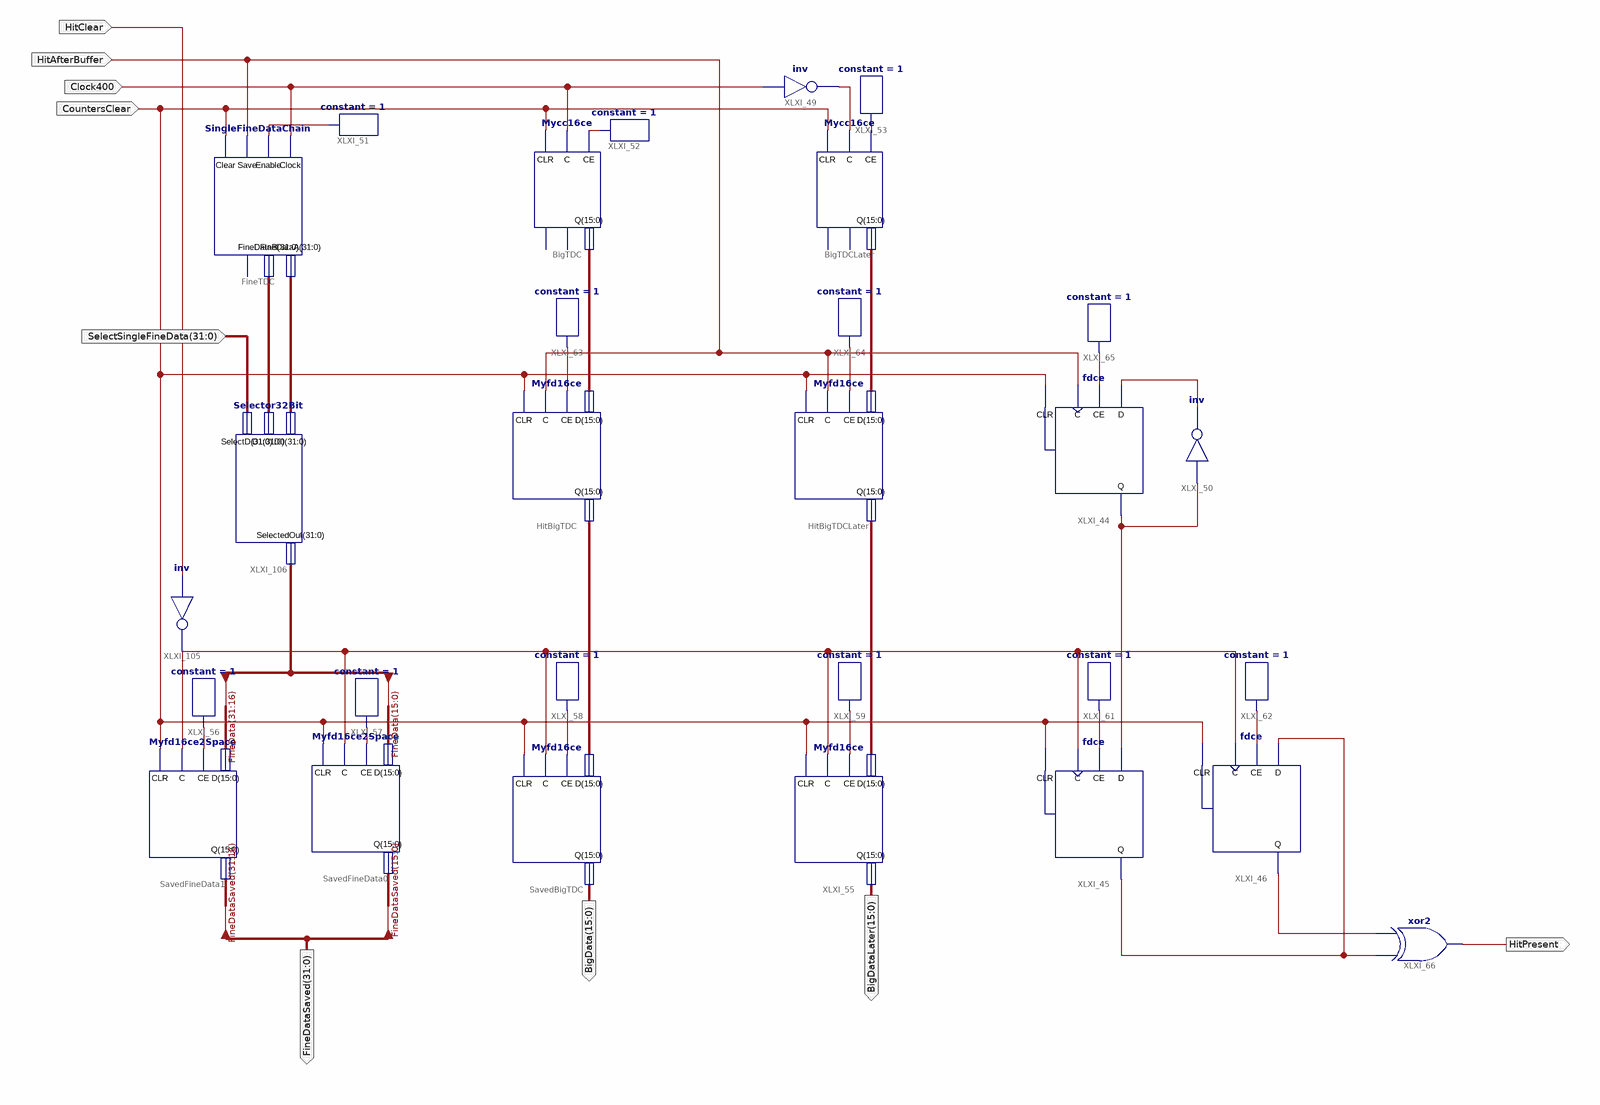
[diagram p0: schematic sheet 1]
// Xilinx ISE schematic SingleTDC.sch (virtex4) as structural Verilog: 29 symbols, 9 ports
module SingleTDC (
  input  Clock400,
  input  HitClear,
  input  HitAfterBuffer,
  input  CountersClear,
  input  [31:0] SelectSingleFineData,
  output [15:0] BigDataLater,
  output [15:0] BigData,
  output [31:0] FineDataSaved,
  output HitPresent
);

  wire InvHitClear, XLXN_193, XLXN_194, XLXN_195, XLXN_220, XLXN_223, XLXN_224, XLXN_234, XLXN_235, XLXN_236,
       XLXN_238, XLXN_239, XLXN_240, XLXN_241, XLXN_242, XLXN_243, XLXN_245, XLXN_337;
  wire [15:0] BigDataBeforeSave, XLXN_188, XLXN_191, XLXN_226;
  wire [31:0] FineData, FineDataA, FineDataB;

  Myfd16ce #(.RLOC("X3Y0")) HitBigTDC (
    .C(HitAfterBuffer), .CE(XLXN_241), .CLR(CountersClear), .D(XLXN_188), .Q(BigDataBeforeSave));
  Myfd16ce #(.RLOC("X3Y24")) HitBigTDCLater (
    .C(HitAfterBuffer), .CE(XLXN_242), .CLR(CountersClear), .D(XLXN_191), .Q(XLXN_226));
  not XLXI_49 (XLXN_193, Clock400);
  fdce #(.RLOC("X3Y9")) XLXI_45 (.C(InvHitClear), .CE(XLXN_239), .CLR(CountersClear), .D(XLXN_194), .Q(XLXN_234));
  fdce #(.RLOC("X3Y9")) XLXI_46 (.C(InvHitClear), .CE(XLXN_240), .CLR(CountersClear), .D(XLXN_234), .Q(XLXN_245));
  Myfd16ce2Space #(.RLOC("X1Y16")) SavedFineData1 (
    .C(InvHitClear), .CE(XLXN_235), .CLR(CountersClear), .D(FineData[31:16]), .Q(FineDataSaved[31:16]));
  Myfd16ce2Space #(.RLOC("X1Y0")) SavedFineData0 (
    .C(InvHitClear), .CE(XLXN_236), .CLR(CountersClear), .D(FineData[15:0]), .Q(FineDataSaved[15:0]));
  constant #(.CValue("1")) XLXI_51 (.O(XLXN_220));
  SingleFineDataChain #(.RLOC("X0Y0")) FineTDC (
    .Clear(CountersClear), .Clock(Clock400), .Enable(XLXN_220), .FineDataA(FineDataA), .FineDataB(FineDataB),
    .Save(HitAfterBuffer));  // open: Carryline_End
  Mycc16ce #(.RLOC("X2Y0")) BigTDC (.C(Clock400), .CE(XLXN_223), .CLR(CountersClear), .Q(XLXN_188));  // open: CEO, TC
  Mycc16ce #(.RLOC("X2Y24")) BigTDCLater (
    .C(XLXN_193), .CE(XLXN_224), .CLR(CountersClear), .Q(XLXN_191));  // open: CEO, TC
  constant #(.CValue("1")) XLXI_52 (.O(XLXN_223));
  constant #(.CValue("1")) XLXI_53 (.O(XLXN_224));
  Myfd16ce #(.RLOC("X4Y24")) XLXI_55 (
    .C(InvHitClear), .CE(XLXN_238), .CLR(CountersClear), .D(XLXN_226), .Q(BigDataLater));
  Myfd16ce #(.RLOC("X4Y0")) SavedBigTDC (
    .C(InvHitClear), .CE(XLXN_337), .CLR(CountersClear), .D(BigDataBeforeSave), .Q(BigData));
  constant #(.CValue("1")) XLXI_56 (.O(XLXN_235));
  constant #(.CValue("1")) XLXI_57 (.O(XLXN_236));
  constant #(.CValue("1")) XLXI_58 (.O(XLXN_337));
  constant #(.CValue("1")) XLXI_59 (.O(XLXN_238));
  constant #(.CValue("1")) XLXI_61 (.O(XLXN_239));
  constant #(.CValue("1")) XLXI_62 (.O(XLXN_240));
  constant #(.CValue("1")) XLXI_63 (.O(XLXN_241));
  constant #(.CValue("1")) XLXI_64 (.O(XLXN_242));
  fdce #(.RLOC("X3Y8")) XLXI_44 (.C(HitAfterBuffer), .CE(XLXN_243), .CLR(CountersClear), .D(XLXN_195), .Q(XLXN_194));
  constant #(.CValue("1")) XLXI_65 (.O(XLXN_243));
  not XLXI_50 (XLXN_195, XLXN_194);
  not XLXI_105 (InvHitClear, HitClear);
  xor XLXI_66 (HitPresent, XLXN_234, XLXN_245);
  Selector32Bit XLXI_106 (.D0(FineDataA), .D1(FineDataB), .SelectD(SelectSingleFineData), .SelectedOut(FineData));
endmodule
